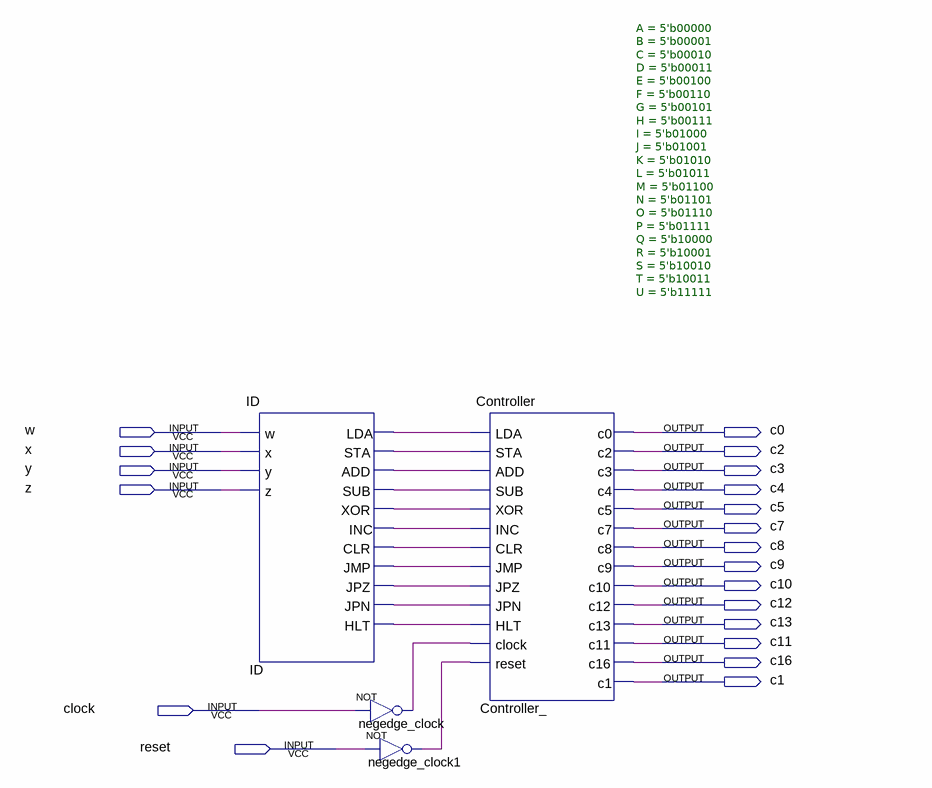
[diagram p0: schematic sheet]
// Quartus schematic ControlUnit.bdf as structural Verilog: 4 symbols, 20 pins
module ControlUnit (
  input  w,
  input  x,
  input  y,
  input  z,
  input  clock,
  input  reset,
  output c0,
  output c2,
  output c3,
  output c4,
  output c5,
  output c7,
  output c8,
  output c9,
  output c10,
  output c12,
  output c13,
  output c11,
  output c16,
  output c1
);

  wire ID_add, ID_clr, ID_hlt, ID_inc, ID_jmp, ID_jpn, ID_jpz, ID_lda, ID_sta, ID_sub, ID_xor,
       negedge_clock1_out, negedge_clock_out;

  ID ID (
    .w(w), .x(x), .y(y), .z(z), .LDA(ID_lda), .STA(ID_sta), .ADD(ID_add), .SUB(ID_sub), .XOR(ID_xor),
    .INC(ID_inc), .CLR(ID_clr), .JMP(ID_jmp), .JPZ(ID_jpz), .JPN(ID_jpn), .HLT(ID_hlt));
  not negedge_clock (negedge_clock_out, clock);
  not negedge_clock1 (negedge_clock1_out, reset);
  Controller #(.A(5'b00000), .B(5'b00001), .C(5'b00010), .D(5'b00011), .E(5'b00100), .F(5'b00110), .G(5'b00101), .H(5'b00111), .I(5'b01000), .J(5'b01001), .K(5'b01010), .L(5'b01011), .M(5'b01100), .N(5'b01101), .O(5'b01110), .P(5'b01111), .Q(5'b10000), .R(5'b10001), .S(5'b10010), .T(5'b10011), .U(5'b11111)) Controller_ (
    .LDA(ID_lda), .STA(ID_sta), .ADD(ID_add), .SUB(ID_sub), .XOR(ID_xor), .INC(ID_inc), .CLR(ID_clr),
    .JMP(ID_jmp), .JPZ(ID_jpz), .JPN(ID_jpn), .HLT(ID_hlt), .clock(negedge_clock_out),
    .reset(negedge_clock1_out), .c0(c0), .c2(c2), .c3(c3), .c4(c4), .c5(c5), .c7(c7), .c8(c8), .c9(c9),
    .c10(c10), .c12(c12), .c13(c13), .c11(c11), .c16(c16), .c1(c1));
endmodule
